# Altium schematic sheet Communication.SchDoc
size A3; Author: Van Hieu; Organization: BACH-KHOA-DK; SheetNumber: 3; SheetTotal: 6; Gmail: maivanhieu24042003@gmail.com
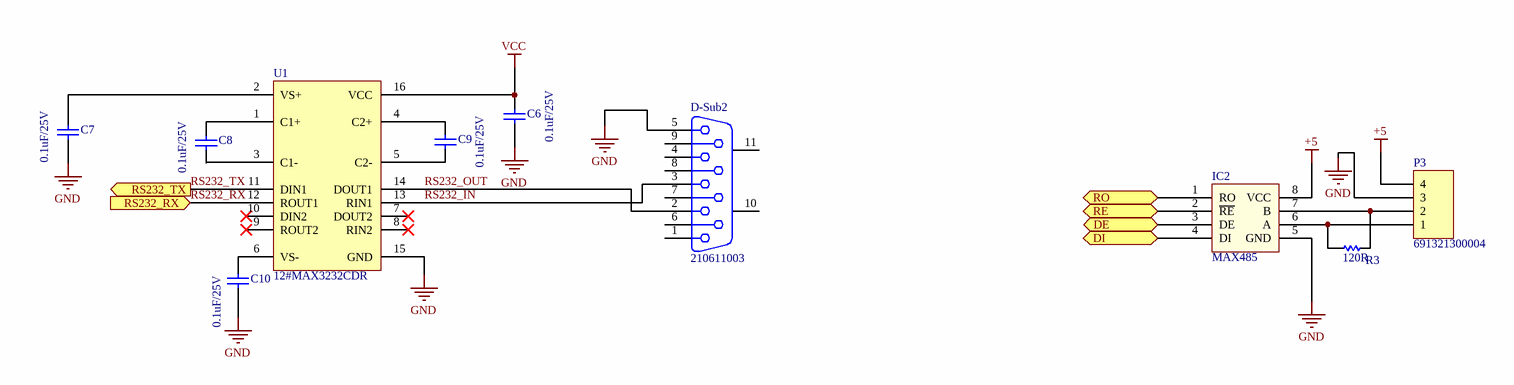
[diagram p0: Communication.SchDoc]

## Parts
C6  0.1uF/25V  [CAP_CERA_C2012(CC0805INCH)]
C7  0.1uF/25V  [CAP_CERA_C2012(CC0805INCH)]
C8  0.1uF/25V  [CAP_CERA_C2012(CC0805INCH)]
C9  0.1uF/25V  [CAP_CERA_C2012(CC0805INCH)]
C10  0.1uF/25V  [CAP_CERA_C2012(CC0805INCH)]
D-Sub2  210611003  [COM9SMDB]
IC2  MAX485  [DIP8/W0.3]
P3  691321300004  [TERMINAL_KF2EDGV_F_1X4_3.81]
R3  120R  [RES-SMD-0805]
U1  12#MAX3232CDR  [12# MAX3232CDR]

## Ports
DE (bidir), DI (bidir), RE (bidir), RO (bidir), RS232_RX (in), RS232_TX (out)

## Nets
+5: IC2.8(VCC) P3.4
GND: C6.1 C7.1 C10.1 D-Sub2.5 IC2.5(GND) P3.3 U1.15(GND)
VCC: C6.2 U1.16(VCC)
DE: IC2.3(DE) ; port DE
DI: IC2.4(DI) ; port DI
RE: IC2.2(~{RE}) ; port RE
RO: IC2.1(RO) ; port RO
RS232_IN: D-Sub2.3 U1.13(RIN1)
RS232_OUT: D-Sub2.2 U1.14(DOUT1)
RS232_RX: U1.12(ROUT1) ; port RS232_RX
RS232_TX: U1.11(DIN1) ; port RS232_TX
NetC7_2: C7.2 U1.2(VS+)
NetC8_1: C8.1 U1.3(C1-)
NetC8_2: C8.2 U1.1(C1+)
NetC9_1: C9.1 U1.5(C2-)
NetC9_2: C9.2 U1.4(C2+)
NetC10_2: C10.2 U1.6(VS-)
NetIC2_6: IC2.6(A) P3.1 R3.1
NetIC2_7: IC2.7(B) P3.2 R3.2

Not connected (* = marked no-connect by the designer): D-Sub2 1 4 6 7 8 9 10(MH1) 11(MH2); U1 7(DOUT2)* 8(RIN2)* 9(ROUT2)* 10(DIN2)*

## Notes on the sheet
- Van Hieu
- Date:
- Size:
- A3
- Number:
- Time:
- Sheet
- Revision:
- of
- BK-DN
- File:
- maivanhieu24042003@gmail.com

## Library data of the parts
C6-C10 = 0.1uF/50V/C0603/10%: 0.1µF ±10% 25V Ceramic Capacitor X7R 0805 (2012 Metric); ComponentLink1URL: http://www.murata.com/~/media/webrenewal/support/library/catalog/products/capacitor/mlcc/c02e.ashx; ComponentLink1Description: http://www.murata.com/~/media/webrenewal/support/library/catalog/products/capacitor/mlcc/c02e.ashx; Digikey: 478-3755-1-ND
D-Sub2 = CON 9BD: D-SUB-Filter Connectors WE-DS, Solder Pin Straight; Manufacturer: Würth Elektronik eiSos GmbH; partNo: 210611003; ComponentLink1Description: Manufacturer; ComponentLink1URL: http://www.we-online.de; Created by: Christin Zierenner; Created Date: May 2012; ComponentLink2Description: Datasheet; ComponentLink2URL: http://katalog.we-online.de/kataloge/eisos/index.php?language=en&pf=Filter_gerade
IC2 = MAX485: RS232 - RS485 (Same sn75176)
P3 = TERMINAL_KF2EDGV_F_1X4_3.81: Pluggable Terminal Blocks WR-TBL Terminal block - PCB Header - THT; Manufacturer: Wurth Elektronik; Connection Method: Push-In; Current Rating: 10 A; Mounting Angle: Straight; Number of Positions: 4 Position; Voltage Rating: 300 VAC; Pitch: 3.81 mm; Supplier 1: Mouser; Manufacturer Part Number: 691321300004; RoHS: RoHS Compliant; Category: Pluggable Terminal Blocks; Stock 1: 0; Pricing 1: 1=0.710, 10=0.638, 50=0.590 (USD); Color: Green; Contact Plating: Tin; Height: 9.2 mm; Housing Material: Polyamide (PA); Length: 16.43 mm; Packaging: Bulk; Product: Headers; Series: WR-TBL; Termination Style: Through Hole; Width: 7.2 mm; Brand: Wurth Elektronik; Contact Material: Brass; Flammability Rating: UL 94 V-0; Mounting Style: PCB Mount; Product Type: Pluggable Terminal Blocks; Standard Pack Qty: 500; Subcategory: Terminal Blocks; RoHS - Mouser: Y; Minimum Order Quantity: 1; Reeling: False; ComponentLink1URL: https://www.mouser.com/datasheet/2/445/691321300004-1719625.pdf; ComponentLink1Description: https://www.mouser.com/datasheet/2/445/691321300004-1719625.pdf; Supplier Part Number 1: 710-691321300004
R3 = Res-SMD_2_2: Resistor; Manufacturer: Generic Components; Class: Passive; Published: 08/06/2000; Publisher: Altium Hobart Technology Centre
U1 = 12#MAX3232CDR: IC DRVR/RCVR MULTCH RS232 16SOIC; Manufacturer: Texas Instruments; Number of Receivers: 2; Data Rate: 250Kbps; Operating Supply Voltage: 5V; Max Supply Voltage: 5.5V; Min Supply Voltage: 3V; Nominal Supply Current: 1mA; Logic Function: Receiver,Transceiver; Number of Transceivers: 1; Output Voltage: 5.4V; Simplex/Duplex: Full Duplex; ESD Protection: Yes; Supplier 1: Digi-Key; Manufacturer Part Number: MAX3232CDR; Stock 1: 41536; Pricing 1: 1=1.89, 10=1.695, 100=1.3624, 500=1.1194, 1000=0.9275 (USD); Mount: Surface Mount; Case/Package: D; Number of Pins: 16; Weight: 0.004998oz; Contact Plating: Gold; Min Operating Temperature: -40°C; Max Operating Temperature: 85°C; Number of Transmitters: 2; Packaging: Tape and Reel; Package Quantity: 1; Number of Drivers: 2; Operating Supply Current: 1mA; Max Supply Current: 1mA; Length: 9.9mm; Height: 1.58mm; Width: 3.91mm; Radiation Hardening: No; REACH SVHC: No SVHC; Lead Free: Lead Free; Supplier Part Number 1: 296-13094-1-ND